# Altium schematic sheet ADJ5V3.3V12V_Sheet_2021-07-20.schdoc
size 260 x 185 mm
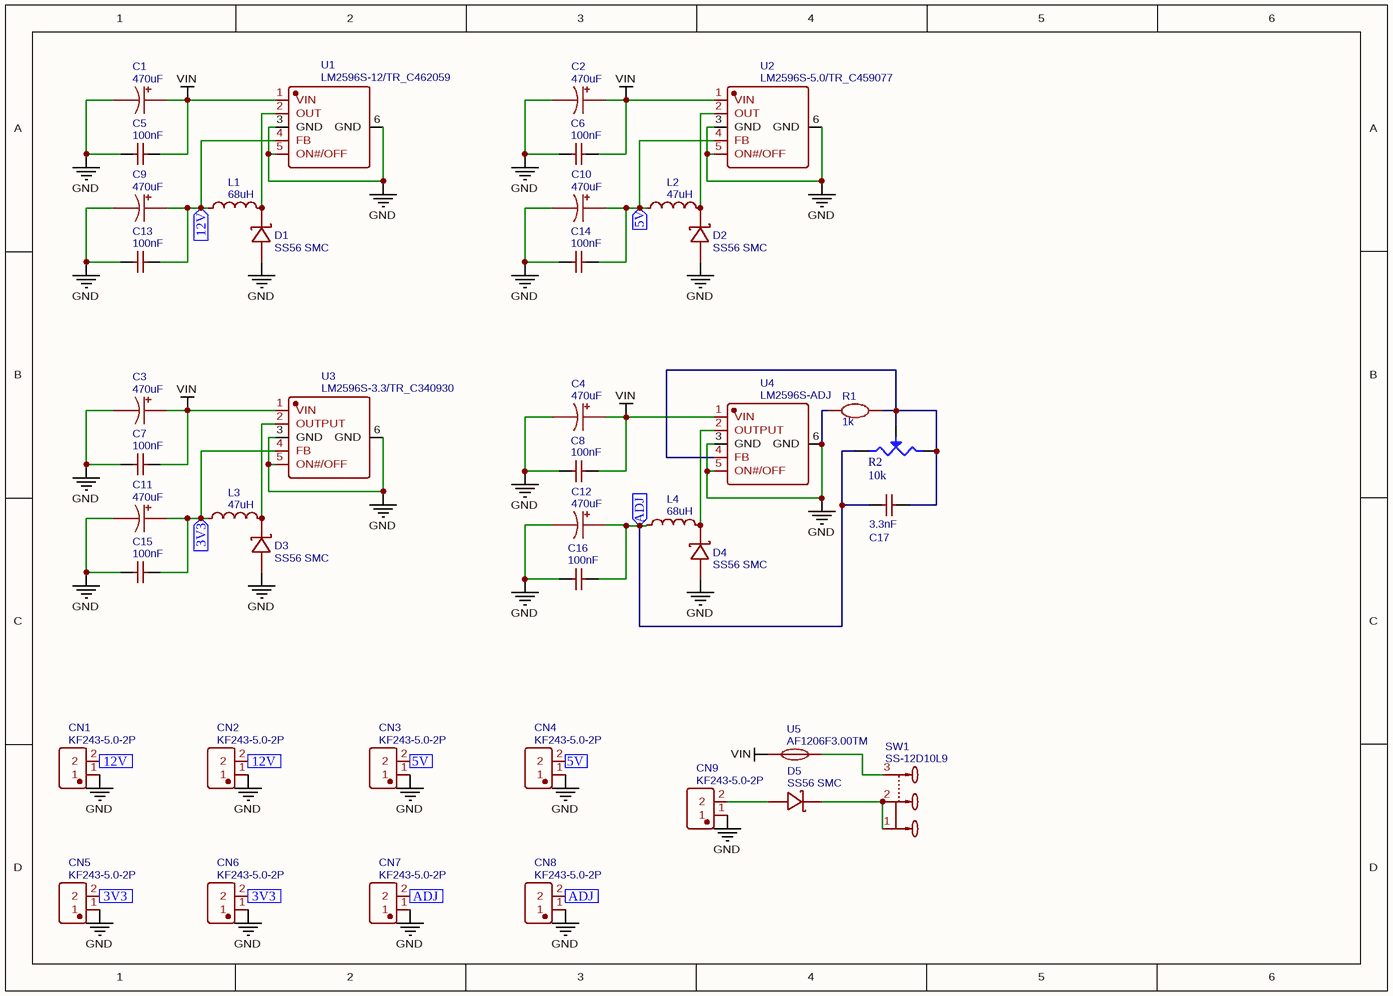
[diagram p0: ADJ5V3.3V12V_Sheet_2021-07-20.schdoc]

## Parts
C1  470uF  [CAP-SMD_BD12.5-L13.0-W13.0-FD]
C2  470uF  [CAP-SMD_BD12.5-L13.0-W13.0-FD]
C3  470uF  [CAP-SMD_BD12.5-L13.0-W13.0-FD]
C4  470uF  [CAP-SMD_BD12.5-L13.0-W13.0-FD]
C5  100nF  [C1210]
C6  100nF  [C1210]
C7  100nF  [C1210]
C8  100nF  [C1210]
C9  470uF  [CAP-SMD_BD12.5-L13.0-W13.0-FD]
C10  470uF  [CAP-SMD_BD12.5-L13.0-W13.0-FD]
C11  470uF  [CAP-SMD_BD12.5-L13.0-W13.0-FD]
C12  470uF  [CAP-SMD_BD12.5-L13.0-W13.0-FD]
C13  100nF  [C1210]
C14  100nF  [C1210]
C15  100nF  [C1210]
C16  100nF  [C1210]
C17  3.3nF  [C1210]
CN1  KF243-5.0-2P  [CONN-TH_P5.00_KF243-5.0-2P]
CN2  KF243-5.0-2P  [CONN-TH_P5.00_KF243-5.0-2P]
CN3  KF243-5.0-2P  [CONN-TH_P5.00_KF243-5.0-2P]
CN4  KF243-5.0-2P  [CONN-TH_P5.00_KF243-5.0-2P]
CN5  KF243-5.0-2P  [CONN-TH_P5.00_KF243-5.0-2P]
CN6  KF243-5.0-2P  [CONN-TH_P5.00_KF243-5.0-2P]
CN7  KF243-5.0-2P  [CONN-TH_P5.00_KF243-5.0-2P]
CN8  KF243-5.0-2P  [CONN-TH_P5.00_KF243-5.0-2P]
CN9  KF243-5.0-2P  [CONN-TH_P5.00_KF243-5.0-2P]
D1  SS56 SMC  [SMC_L7.1-W6.2-LS8.1-FD]
D2  SS56 SMC  [SMC_L7.1-W6.2-LS8.1-FD]
D3  SS56 SMC  [SMC_L7.1-W6.2-LS8.1-FD]
D4  SS56 SMC  [SMC_L7.1-W6.2-LS8.1-FD]
D5  SS56 SMC  [SMC_L7.1-W6.2-LS8.1-FD]
L1  68uH  [IND-SMD_L11.5-W10.0]
L2  47uH  [IND-SMD_L11.5-W10.0]
L3  47uH  [IND-SMD_L11.5-W10.0]
L4  68uH  [IND-SMD_L11.5-W10.0]
R1  1k  [R0805]
R2  10k
SW1  SS-12D10L9  [SW-TH_SS-12D10L9]
U1  LM2596S-12/TR_C462059  [TO-263-5_L10.6-W9.6-P1.70-LS15.9-BR]
U2  LM2596S-5.0/TR_C459077  [TO-263-5_L10.6-W9.6-P1.70-LS15.9-BR]
U3  LM2596S-3.3/TR_C340930  [TO-263-5_L10.6-W9.6-P1.70-LS15.9-BR]
U4  LM2596S-ADJ  [TO-263-5_L10.6-W9.6-P1.70-LS15.9-BR]
U5  AF1206F3.00TM  [F1206]

## Ports
3V3 (in), 5V (in), 12V (in), ADJ (in)

## Nets
GND: C1.2 C2.2 C3.2 C4.2 C5.1 C6.1 C7.1 C8.1 C9.2 C10.2 C11.2 C12.2 C13.1 C14.1 C15.1 C16.1 CN1.1 CN2.1 CN3.1 CN4.1 CN5.1 CN6.1 CN7.1 CN8.1 CN9.1 D1.1(A) D2.1(A) D3.1(A) D4.1(A) R1.2 U1.3(GND) U1.5(ON#/OFF) U1.6(GND) U2.3(GND) U2.5(ON#/OFF) U2.6(GND) U3.3(GND) U3.5(ON#/OFF) U3.6(GND) U4.3(GND) U4.5(ON#/OFF) U4.6(GND)
VIN: C1.1 C2.1 C3.1 C4.1 C5.2 C6.2 C7.2 C8.2 U1.1(VIN) U2.1(VIN) U3.1(VIN) U4.1(VIN) U5.1
3V3: C11.1 C15.2 CN5.2 CN6.2 L3.1 U3.4(FB) ; port 3V3
5V: C10.1 C14.2 CN3.2 CN4.2 L2.1 U2.4(FB) ; port 5V
12V: C9.1 C13.2 CN1.2 CN2.2 L1.1 U1.4(FB) ; port 12V
ADJ: C12.1 C16.2 C17.1 CN7.2 CN8.2 L4.1 R2.1 ; port ADJ
NetC17_2: C17.2 R1.1 R2.2 R2.3(W) U4.4(FB)
NetCN9_2: CN9.2 D5.1(A)
NetD1_2: D1.2(K) L1.2 U1.2(OUT)
NetD2_2: D2.2(K) L2.2 U2.2(OUT)
NetD3_2: D3.2(K) L3.2 U3.2(OUTPUT)
NetD4_2: D4.2(K) L4.2 U4.2(OUTPUT)
NetD5_2: D5.2(K) SW1.1 SW1.2
NetSW1_3: SW1.3 U5.2

## Library data of the parts
C1-C4 C9-C12 = 470uF: BOM_Manufacturer: LELON; BOM_Manufacturer Part: VEJ471M1HTR-1316; nameAlias: Capacitance; Contributor: LCSC; BOM_Supplier: LCSC; BOM_Supplier Part: C108926; spicePre: C; spiceSymbolName: VEJ471M1HTR-1316
C5-C8 C13-C17 = 100nF: BOM_Manufacturer: HEC; BOM_Manufacturer Part: C1210X104K251T; nameAlias: Capacitance; BOM_Supplier: LCSC; BOM_Supplier Part: C106103; spicePre: C; spiceSymbolName: C1210X104K251T
CN1-CN9 = KF243-5.0-2P: BOM_Manufacturer: Cixi Kefa Elec; Contributor: LCSC; BOM_Supplier: LCSC; BOM_Supplier Part: C475222; BOM_Manufacturer Part: KF243-5.0-2P; spicePre: C; spiceSymbolName: KF243-5.0-2P
D1-D5 = SS56 SMC: BOM_Manufacturer: MDD; SMT Type: Extend; BOM_Supplier: LCSC; BOM_Manufacturer Part: SS56 SMC; image: //image.lceda.cn/szlcsc/C24138.jpg; BOM_Supplier Part: C24138; BOM_LCSC Assembly: Yes; spicePre: D; spiceSymbolName: SS56 SMC
L1 L4 = 68uH: BOM_Manufacturer: YJYCOIN; nameAlias: Inductance; Contributor: LCSC; BOM_Supplier: LCSC; BOM_Supplier Part: C497902; spicePre: L; spiceSymbolName: MS1360-680M
L2 L3 = 47uH: BOM_Manufacturer: YJYCOIN; nameAlias: Inductance; Contributor: LCSC; BOM_Supplier: LCSC; BOM_Supplier Part: C497901; spicePre: L; spiceSymbolName: SMMS1050-470M
R1 = 1k: nameAlias: Value(Ω); Contributor: LCEDA_Lib; spicePre: R; spiceSymbolName: R_0805_EU
R2 = R-GLIDE
SW1 = SS-12D10L9: BOM_Manufacturer: XKB Enterprise; Contributor: LCSC; BOM_Supplier: LCSC; BOM_Supplier Part: C319011; BOM_Manufacturer Part: SS-12D10L9; spicePre: S; spiceSymbolName: SS-12D10L9
U1 = LM2596S-12/TR_C462059: BOM_Manufacturer: HGC(Huaguan Semicon); Contributor: LCSC; BOM_Supplier: LCSC; BOM_Supplier Part: C462059; BOM_Manufacturer Part: LM2596S-12/TR; spicePre: U; spiceSymbolName: LM2596S-12/TR_C462059
U2 = LM2596S-5.0/TR_C459077: BOM_Manufacturer: HGC(Huaguan Semicon); Contributor: LCSC; BOM_Supplier: LCSC; BOM_Supplier Part: C459077; BOM_Manufacturer Part: LM2596S-5.0/TR; spicePre: U; spiceSymbolName: LM2596S-5.0/TR_C459077
U3 = LM2596S-3.3/TR_C340930: BOM_Manufacturer: Huaguan Semicon; Contributor: LCSC; BOM_Supplier: LCSC; BOM_Supplier Part: C340930; BOM_Manufacturer Part: LM2596S-3.3/TR; spicePre: U; spiceSymbolName: LM2596S-3.3/TR_C340930
U4 = LM2596S-ADJ/TR_C340933: BOM_Manufacturer: Huaguan Semicon; Contributor: LCSC; BOM_Supplier: LCSC; BOM_Supplier Part: C340933; BOM_Manufacturer Part: LM2596S-ADJ/TR; spicePre: U; spiceSymbolName: LM2596S-ADJ/TR_C340933
U5 = AF1206F3.00TM: BOM_Manufacturer: AEM; Contributor: LCSC; BOM_Supplier: LCSC; BOM_Supplier Part: C311025; BOM_Manufacturer Part: AF1206F3.00TM; spicePre: U; spiceSymbolName: AF1206F3.00TM